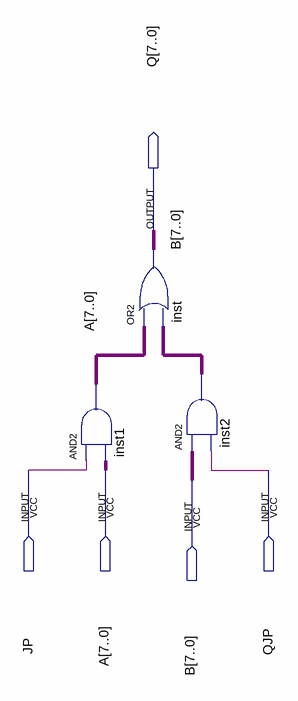
[diagram p0: schematic sheet]
// Quartus schematic selector.bdf as structural Verilog: 3 symbols, 5 pins
module selector (
  input  JP,
  input  [7:0] A,
  input  QJP,
  input  [7:0] B,
  output [7:0] Q
);

  wire [7:0] inst1_out, inst2_out;

  assign inst1_out = {8{JP}} & A;  // AND2 inst1, 8 bits wide
  assign Q = inst1_out | inst2_out;  // OR2 inst, 8 bits wide
  assign inst2_out = B & {8{QJP}};  // AND2 inst2, 8 bits wide
endmodule
